# Altium schematic sheet POWER.SchDoc
size A4
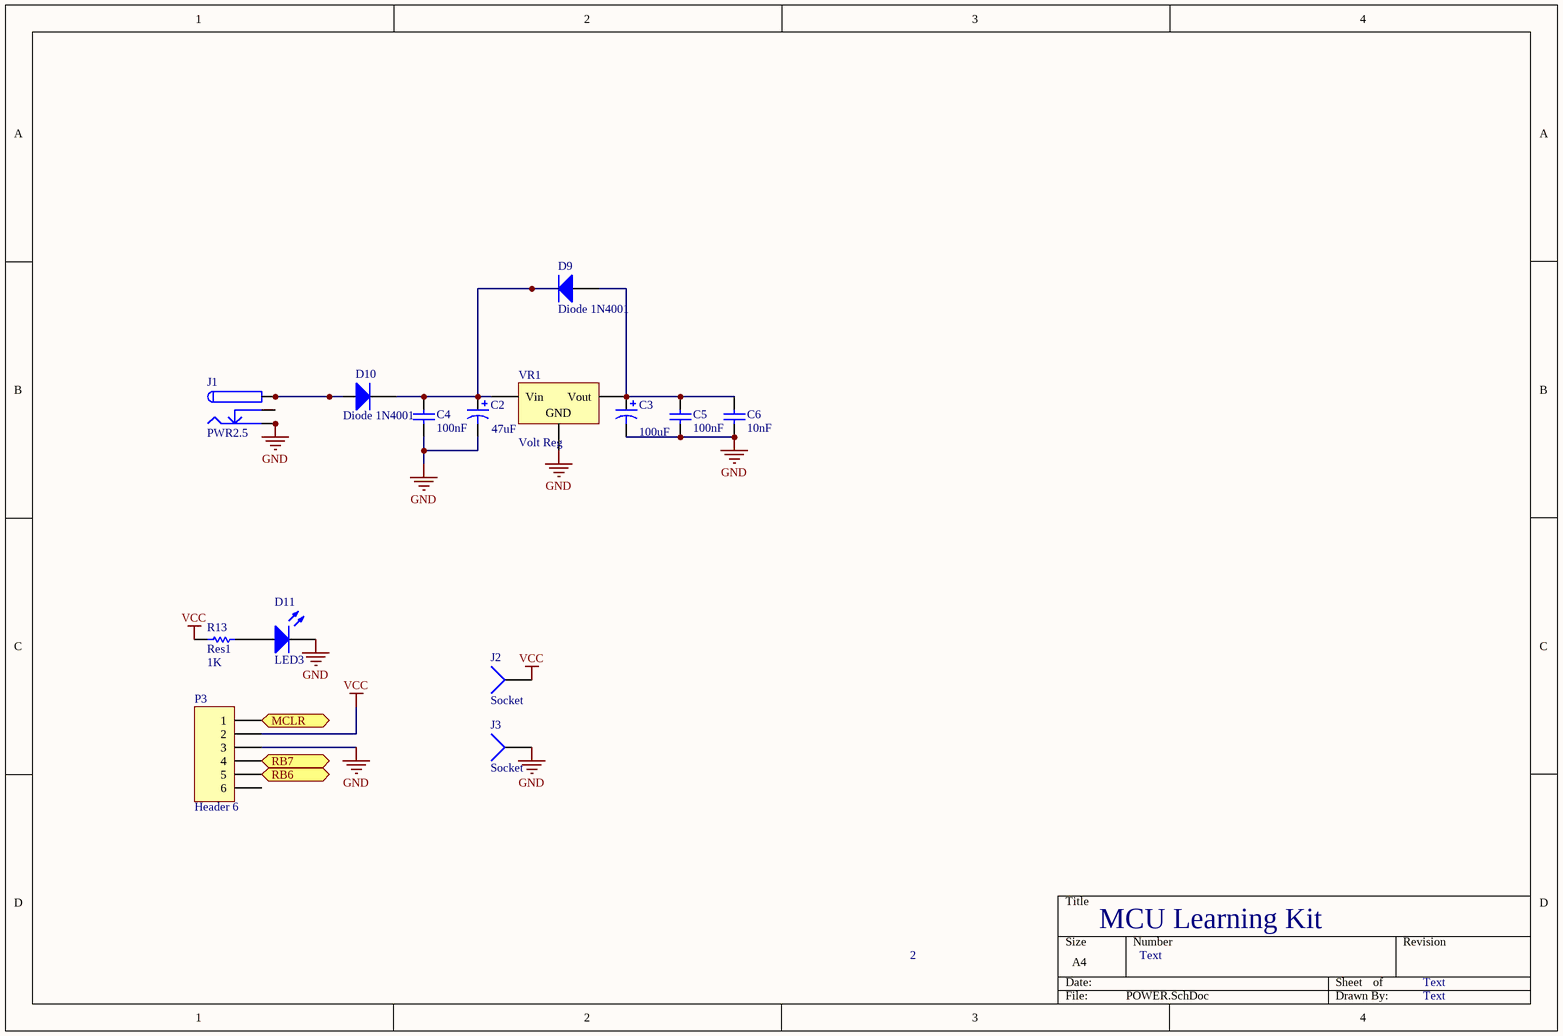
[diagram p0: POWER.SchDoc]

## Parts
C2  value 47uF  [RB7.6-15]  (hidden comment: Cap Pol1)
C3  value 100uF  [RB7.6-15]  (hidden comment: Cap Pol1)
C4  value 100nF  [CAPC1005M]  (hidden comment: Cap)
C5  value 100nF  [CAPC1005M]  (hidden comment: Cap)
C6  value 10nF  [CAPC1005M]  (hidden comment: Cap)
D9  Diode 1N4001  [DO-41]
D10  Diode 1N4001  [DO-41]
D11  LED3  [3.5X2.8X1.9]
J1  PWR2.5  [KLD-0202]
J2  Socket  [PIN1]
J3  Socket  [PIN1]
P3  Header 6  [HDR1X6]
R13  Res1  value 1K  [AXIAL-0.3]
VR1  Volt Reg  [SOT89M]

## Ports
MCLR, RB6, RB7

## Nets
GND: C2.2 C3.2 C4.1 C5.1 C6.1 D11.2(K) J1.2A J1.2B J3.1 P3.3 VR1.2(GND)
VCC: J2.1 P3.2 R13.1
MCLR: P3.1 ; port MCLR
RB6: P3.5 ; port RB6
RB7: P3.4 ; port RB7
NetC2_1: C2.1 C4.2 D9.2(K) D10.2(K) VR1.1(Vin)
NetC3_1: C3.1 C5.2 C6.2 D9.1(A) VR1.3(Vout)
NetD10_1: D10.1(A) J1.1A J1.1B
NetD11_1: D11.1(A) R13.2
NetJ1_3A: J1.3A J1.3B

Not connected (* = marked no-connect by the designer): J1 1 2 3; P3 6

## Notes on the sheet
- 2
- MCU Learning Kit
- Text

## Library data of the parts
C2 C3 = Cap Pol1: Polarized Capacitor (Radial); Published: 8-Jun-2000; LatestRevisionDate: 17-Jul-2002; LatestRevisionNote: Re-released for DXP Platform.; PackageReference: RB7.6-15; Publisher: Altium Limited
C4-C6 = Cap: CAP CER 0.1uF 50V 0805; Published: 8-Jun-2000; LatestRevisionDate: 17-Jul-2002; LatestRevisionNote: Re-released for DXP Platform.; PackageReference: RAD-0.3; Publisher: Altium Limited
D9 D10 = Diode 1N4001: 1 Amp General Purpose Rectifier; Published: 8-Jun-2000; LatestRevisionDate: 17-Jul-2002; LatestRevisionNote: Re-released for DXP Platform.; DatasheetDocument: 1998; PackageDocument: Aug-1999; PackageReference: DO-41; Publisher: Altium Limited; Code_JEDEC: DO-204-AL; ComponentLink1Description: Manufacturer Link; ComponentLink1URL: http://www.fairchildsemi.com/; ComponentLink2Description: Datasheet; ComponentLink2URL: http://www.fairchildsemi.com/ds/1N%2F1N4001.pdf
D11 = LED3: Typical BLUE SiC LED; Published: 8-Jun-2000; LatestRevisionDate: 17-Dec-2003; LatestRevisionNote: PCB Footprint replaced.; DatasheetDocument: 16-Apr-2002; PackageDocument: 16-Apr-2002; PackageReference: 3.5X2.8X1.9; Publisher: Altium Limited
J1 = PWR2.5: Low Voltage Power Supply Connector; Published: 17-Dec-2003; DatasheetDocument: 09-May-2002; Publisher: Altium Limited; ComponentLink1Description: Manufacturer Link; ComponentLink1URL: http://domino.kycon.com/internet/Products.html
P3 = Header 6: Header, 6-Pin; LatestRevisionDate: 17-Jul-2002; LatestRevisionNote: Re-released for DXP Platform.; Publisher: Altium Limited
R13 = Res1: Resistor; Published: 8-Jun-2000; LatestRevisionDate: 17-Jul-2002; LatestRevisionNote: Re-released for DXP Platform.; PackageReference: AXIAL-0.3; Publisher: Altium Limited
VR1 = Volt Reg: Voltage Regulator; Published: 24-Mar-1999; LatestRevisionDate: 17-Jul-2002; LatestRevisionNote: Re-released for DXP Platform.; PackageReference: D2PAK; Publisher: Altium Limited; Code_JEDEC: SMD-220
J2 J3 = Socket: LatestRevisionDate: 17-Jul-2002; LatestRevisionNote: Re-released for DXP Platform.; Publisher: Altium Limited